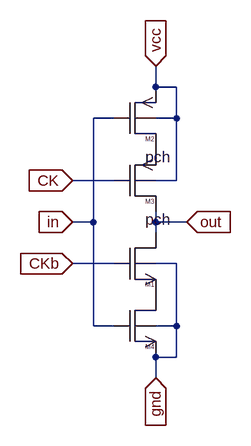
[diagram p0: schematic myinv_c.asc]
myinv_c.asc, the LTspice schematic file:
Version 4
SHEET 1 880 680
WIRE 176 32 176 0
WIRE 208 32 176 32
WIRE 112 80 80 80
WIRE 208 80 208 32
WIRE 208 80 176 80
WIRE 112 176 48 176
WIRE 208 176 208 80
WIRE 208 176 176 176
WIRE 80 240 80 80
WIRE 80 240 48 240
WIRE 176 240 176 224
WIRE 224 240 176 240
WIRE 176 256 176 240
WIRE 112 304 48 304
WIRE 208 304 176 304
WIRE 80 400 80 240
WIRE 112 400 80 400
WIRE 208 400 208 304
WIRE 208 400 176 400
WIRE 208 448 208 400
WIRE 208 448 176 448
WIRE 176 480 176 448
FLAG 176 480 gnd
IOPIN 176 480 In
FLAG 176 0 vcc
IOPIN 176 0 In
FLAG 48 240 in
IOPIN 48 240 In
FLAG 224 240 out
IOPIN 224 240 In
FLAG 48 176 CK
IOPIN 48 176 In
FLAG 48 304 CKb
IOPIN 48 304 In
SYMBOL nmos4 112 304 R0
SYMATTR InstName M1
SYMATTR SpiceModel nch
SYMATTR Value2 l=2u w=6u
SYMBOL pmos4 112 80 R0
WINDOW 3 48 60 Left 2
SYMATTR InstName M2
SYMATTR Value pch
SYMATTR Value2 l=2u w=18u
SYMBOL pmos4 112 176 R0
WINDOW 3 48 60 Left 2
SYMATTR InstName M3
SYMATTR Value pch
SYMATTR Value2 l=2u w=18u
SYMBOL nmos4 112 400 R0
SYMATTR InstName M4
SYMATTR SpiceModel nch
SYMATTR Value2 l=2u w=6u

The netlist it stands for:
* myinv_c.asc
M1 out CKb P001 gnd nch l=2u w=6u
M2 P002 in vcc vcc pch l=2u w=18u
M3 out CK P002 vcc pch l=2u w=18u
M4 P001 in gnd gnd nch l=2u w=6u
.model NMOS NMOS
.model PMOS PMOS
.lib standard.mos
.backanno
.end